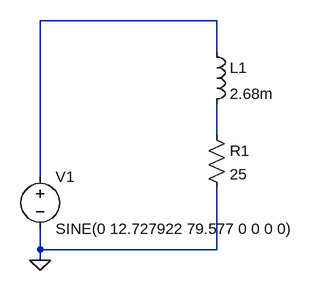
[diagram p0: schematic scheme5.asc]
scheme5.asc, the LTspice schematic file:
Version 4
SHEET 1 880 680
WIRE 432 -112 160 -112
WIRE 432 -64 432 -112
WIRE 432 64 432 16
WIRE 160 128 160 -112
WIRE 160 240 160 208
WIRE 432 240 432 144
WIRE 432 240 160 240
WIRE 160 256 160 240
FLAG 160 256 0
SYMBOL voltage 160 112 R0
WINDOW 123 0 0 Left 0
WINDOW 39 0 0 Left 0
SYMATTR InstName V1
SYMATTR Value SINE(0 12.727922 79.577 0 0 0 0)
SYMBOL res 416 48 R0
SYMATTR InstName R1
SYMATTR Value 25
SYMBOL ind 416 -80 R0
SYMATTR InstName L1
SYMATTR Value 2.68m

The netlist it stands for:
* scheme5.asc
V1 N001 0 SINE(0 12.727922 79.577 0 0 0 0)
R1 N002 0 25
L1 N001 N002 2.68m
.backanno
.end